# EAGLE design OBD_Reader (EAGLE 7.2.0)
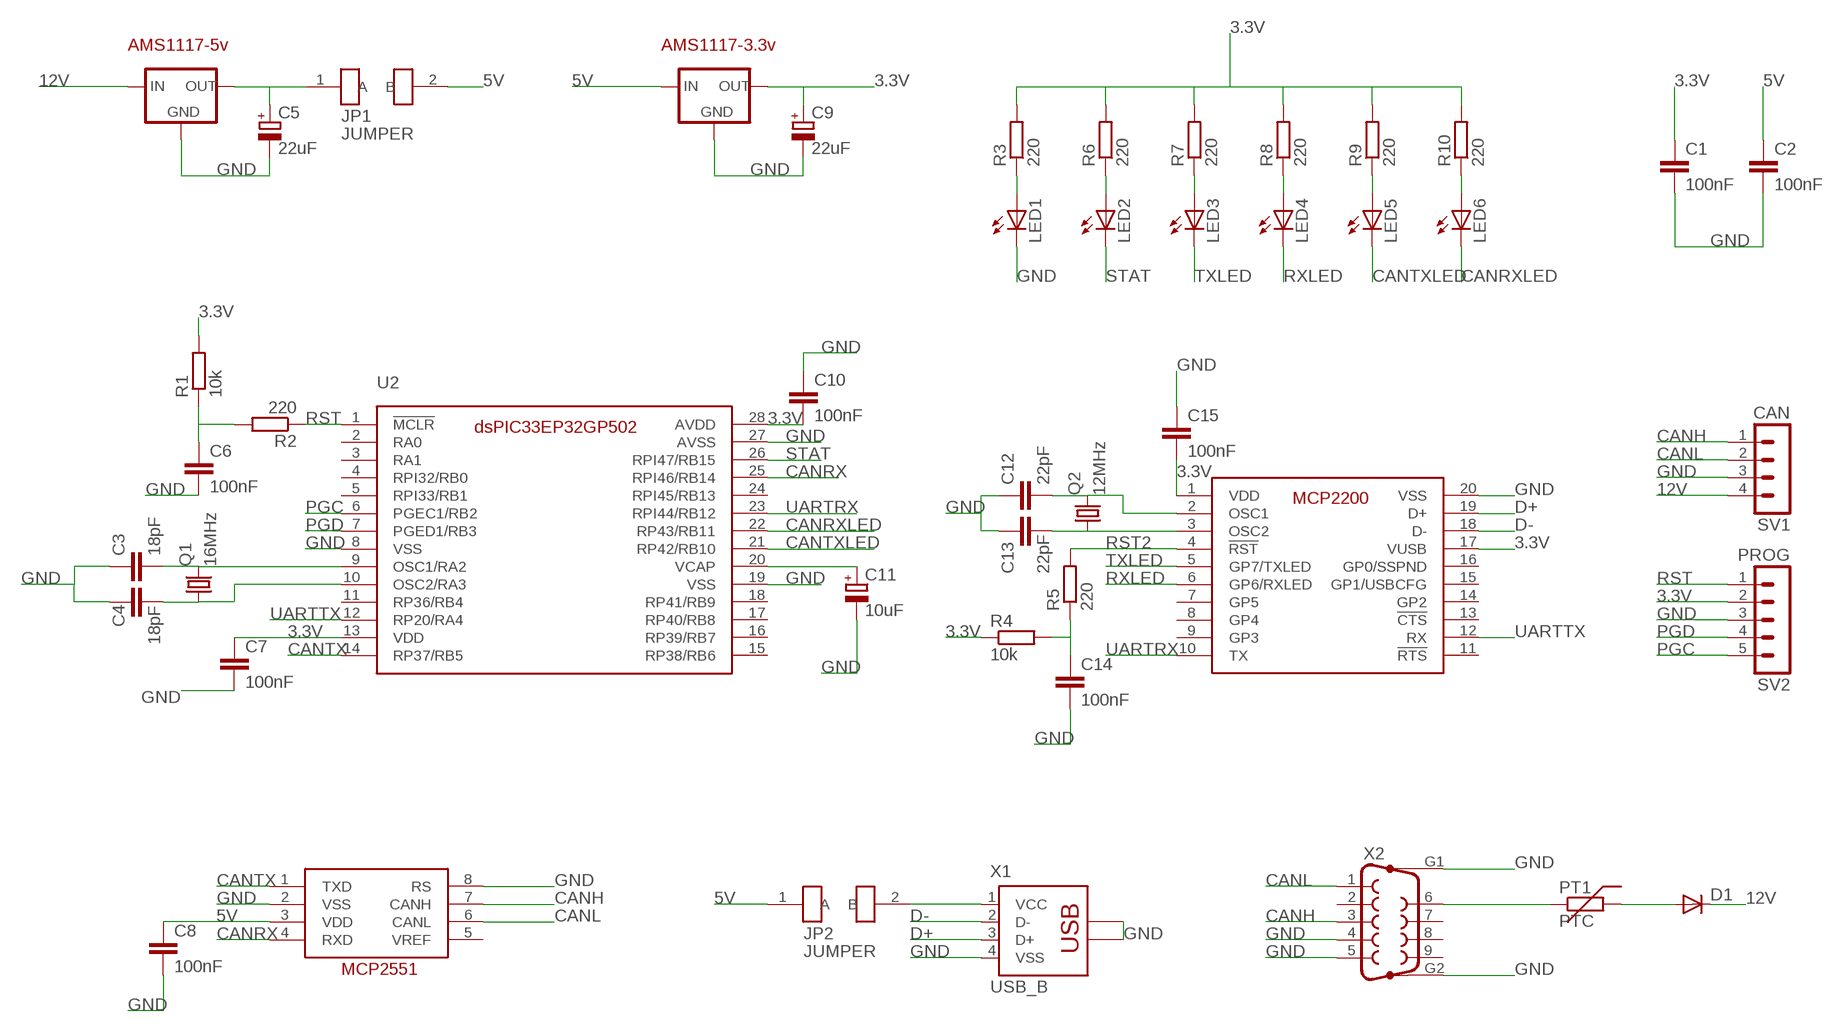
[diagram p0: schematic, sheet 1]

## Parts
C1  100nF  C-EUC0603  [C0603]
C2  100nF  C-EUC0603  [C0603]
C3  18pF  C-EUC0603  [C0603]
C4  18pF  C-EUC0603  [C0603]
C5  22uF  CPOL-EUCT3216  [CT3216]
C6  100nF  C-EUC0603  [C0603]
C7  100nF  C-EUC0603  [C0603]
C8  100nF  C-EUC0603  [C0603]
C9  22uF  CPOL-EUCT3216  [CT3216]
C10  100nF  C-EUC0603  [C0603]
C11  10uF  CPOL-EUCT3216  [CT3216]
C12  22pF  C-EUC0603  [C0603]
C13  22pF  C-EUC0603  [C0603]
C14  100nF  C-EUC0603  [C0603]
C15  100nF  C-EUC0603  [C0603]
D1  DIODE-SMB  [SMB]
JP1  JUMPER  [1206]
JP2  JUMPER  [1206]
LED1  LEDCHIPLED_0603  [CHIPLED_0603]
LED2  LEDCHIPLED_0603  [CHIPLED_0603]
LED3  LEDCHIPLED_0603  [CHIPLED_0603]
LED4  LEDCHIPLED_0603  [CHIPLED_0603]
LED5  LEDCHIPLED_0603  [CHIPLED_0603]
LED6  LEDCHIPLED_0603  [CHIPLED_0603]
PT1  PTC  [PTC_1206]
Q1  16MHz  CRYSTALHC49S  [HC49/S]
Q2  12MHz  CRYSTALHC49S  [HC49/S]
R1  10k  R-EU_R0603  [R0603]
R2  220  R-EU_R0603  [R0603]
R3  220  R-EU_R0603  [R0603]
R4  10k  R-EU_R0603  [R0603]
R5  220  R-EU_R0603  [R0603]
R6  220  R-EU_R0603  [R0603]
R7  220  R-EU_R0603  [R0603]
R8  220  R-EU_R0603  [R0603]
R9  220  R-EU_R0603  [R0603]
R10  220  R-EU_R0603  [R0603]
SV1  CAN  MA04-1  [MA04-1]
SV2  PROG  MA05-1  [MA05-1]
U1  AMS1117_5V  [SOT-223]
U2  DSPIC33EP32GP502  [SSOP28]
U3  MCP2551  [SOIC20]
U4  AMS1117_3.3V  [SOT-223]
U5  MCP2200  [SSOP20]
X1  USB_B  [85-32004-00X]
X2  F09HP  [F09HP]

## Nets
3.3V: C1.1 C7.1 C9.+ C10.2 C15.2 R1.2 R3.2 R4.1 R6.2 R7.2 R8.2 R9.2 R10.2 SV2.2 U2.13(VDD) U2.28(AVDD) U4.2(OUT) U5.1(VDD) U5.17(VUSB)
5V: C2.1 C8.1 JP1.2(B) JP2.1(A) U3.3(VDD) U4.3(IN)
12V: D1.C SV1.4 U1.3(IN)
CANH: SV1.1 U3.7(CANH) X2.3
CANL: SV1.2 U3.6(CANL) X2.1
CANRX: U2.25(RPI46/RB14) U3.4(RXD)
CANRXLED: LED6.C U2.22(RP43/RB11)
CANTX: U2.14(RP37/RB5) U3.1(TXD)
CANTXLED: LED5.C U2.21(RP42/RB10)
D+: U5.19(D+) X1.3(D+)
D-: U5.18(D-) X1.2(D-)
GND: C1.2 C2.2 C3.1 C4.1 C5.- C6.2 C7.2 C8.2 C9.- C10.1 C11.- C12.1 C13.1 C14.2 C15.1 LED1.C SV1.3 SV2.3 U1.1(GND) U2.8(VSS) U2.19(VSS) U2.27(AVSS) U3.2(VSS) U3.8(RS) U4.1(GND) U5.20(VSS) X1.4(VSS) X1.M1(C1) X1.M2(C2) X2.4 X2.5 X2.G1 X2.G2
N$1: C3.2 Q1.2 U2.9(OSC1/RA2)
N$2: C4.2 Q1.1 U2.10(OSC2/RA3)
N$3: C14.1 R4.2 R5.1
N$4: C12.2 Q2.2 U5.2(OSC1)
N$5: C13.2 Q2.1 U5.3(OSC2)
N$6: C6.1 R1.1 R2.2
N$7: JP2.2(B) X1.1(VCC)
N$8: D1.A PT1.2
N$9: PT1.1 X2.6
N$10: C5.+ JP1.1(A) U1.2(OUT)
N$15: LED1.A R3.1
N$16: LED2.A R6.1
N$17: LED3.A R7.1
N$18: LED4.A R8.1
N$19: LED5.A R9.1
N$20: LED6.A R10.1
N$30: C11.+ U2.20(VCAP)
PGC: SV2.5 U2.6(PGEC1/RB2)
PGD: SV2.4 U2.7(PGED1/RB3)
RST: R2.1 SV2.1 U2.1(!MCLR)
RST2: R5.2 U5.4(!RST)
RXLED: LED4.C U5.6(GP6/RXLED)
STAT: LED2.C U2.26(RPI47/RB15)
TXLED: LED3.C U5.5(GP7/TXLED)
UARTRX: U2.23(RPI44/RB12) U5.10(TX)
UARTTX: U2.12(RP20/RA4) U5.12(RX)
Unconnected: U2.2(RA0) U2.3(RA1) U2.4(RPI32/RB0) U2.5(RPI33/RB1) U2.11(RP36/RB4) U2.15(RP38/RB6) U2.16(RP39/RB7) U2.17(RP40/RB8) U2.18(RP41/RB9) U2.24(RPI45/RB13) U3.5(VREF) U5.7(GP5) U5.8(GP4) U5.9(GP3) U5.11(!RTS) U5.13(!CTS) U5.14(GP2) U5.15(GP1/USBCFG) U5.16(GP0/SSPND) X2.2 X2.7 X2.8 X2.9

## Library data of the parts
C1-C4 C6-C8 C10 C12-C15 = resistor:C-EU: CAPACITOR, European symbol
C5 C9 C11 = resistor:CPOL-EU: POLARIZED CAPACITOR, European symbol
D1 = diode:DIODE-: DIODE
JP1 JP2 = Rober-Microchip:JUMPER
LED1-LED6 = led:LED: LED OSRAM: - CHIPLED LG R971, LG N971, LY N971, LG Q971, LY Q971, LO R971, LY R971 LH N974, LH R974 LS Q976, LO Q976, LY Q976 LO Q996 - Hyper CHIPLED LW Q18S LB Q993, LB Q99A, LB R99A - SideLED LS A670, LO A670, LY A670, LG A670, LP A670 LB A673, LV A673, LT A673, LW A673 LH A674 LY A675 LS A676, LA A676, LO A676, LY A676, LW A676 LS A679, LY A679, LG A679 - Hyper Micro SIDELED® LS Y876, LA Y876, LO Y876, LY Y876 LT Y87S - SmartLED LW L88C, LW L88S LB L89C, LB L89S, LG L890 LS L89K, LO L89K, LY L89K LS L896, LA L896, LO L896, LY L896 - TOPLED LS T670, LO T670, LY T670, LG T670, LP T670 LSG T670, LSP T670, LSY T670, LOP T670, LYG T670 LG T671, LOG T671, LSG T671 LB T673, LV T673, LT T673, LW T673 LH T674 LS T676, LA T676, LO T676, LY T676, LB T676, LH T676, LSB T676, LW T676 LB T67C, LV T67C, LT T67C, LS T67K, LO T67K, LY T67K, LW E67C LS E67B, LA E67B, LO E67B, LY E67B, LB E67C, LV E67C, LT E67C LW T67C LS T679, LY T679, LG T679 LS T770, LO T770, LY T770, LG T770, LP T770 LB T773, LV T773, LT T773, LW T773 LH T774 LS E675, LA E675, LY E675, LS T675 LS T776, LA T776, LO T776, LY T776, LB T776 LHGB T686 LT T68C, LB T68C - Hyper Mini TOPLED® LB M676 - Mini TOPLED Santana® LG M470 LS M47K, LO M47K, LY M47K Source: http://www.osram.convergy.de LUXEON: - LUMILED® LXK2-PW12-R00, LXK2-PW12-S00, LXK2-PW14-U00, LXK2-PW14-V00 LXK2-PM12-R00, LXK2-PM12-S00, LXK2-PM14-U00 LXK2-PE12-Q00, LXK2-PE12-R00, LXK2-PE12-S00, LXK2-PE14-T00, LXK2-PE14-U00 LXK2-PB12-K00, LXK2-PB12-L00, LXK2-PB12-M00, LXK2-PB14-N00, LXK2-PB14-P00, LXK2-PB14-Q00 LXK2-PR12-L00, LXK2-PR12-M00, LXK2-PR14-Q00, LXK2-PR14-R00 LXK2-PD12-Q00, LXK2-PD12-R00, LXK2-PD12-S00 LXK2-PH12-R00, LXK2-PH12-S00 LXK2-PL12-P00, LXK2-PL12-Q00, LXK2-PL12-R00 Source: www.luxeon.com KINGBRIGHT: KA-3528ASYC Source: www.kingbright.com
PT1 = Rober-Microchip:PTC
Q1 Q2 = crystal:CRYSTAL: CRYSTAL; OC_FARNELL: 1667008; OC_NEWARK: unknown
R1-R10 = resistor:R-EU_: RESISTOR, European symbol
SV1 = con-lstb:MA04-1: PIN HEADER; OC_FARNELL: unknown; OC_NEWARK: unknown
SV2 = con-lstb:MA05-1: PIN HEADER; OC_FARNELL: unknown; OC_NEWARK: unknown
U1 = Rober-Microchip:AMS1117_5V
U2 = Rober-Microchip:DSPIC33EP32GP502: dsPIC33EP32GP502
U3 = Rober-Microchip:MCP2551: MCP2551
U4 = Rober-Microchip:AMS1117_3.3V
U5 = Rober-Microchip:MCP2200: MCP2200
X1 = Rober-Microchip:USB_B
X2 = con-subd:F09HP: SUB-D; OC_FARNELL: unknown; OC_NEWARK: unknown

## Board
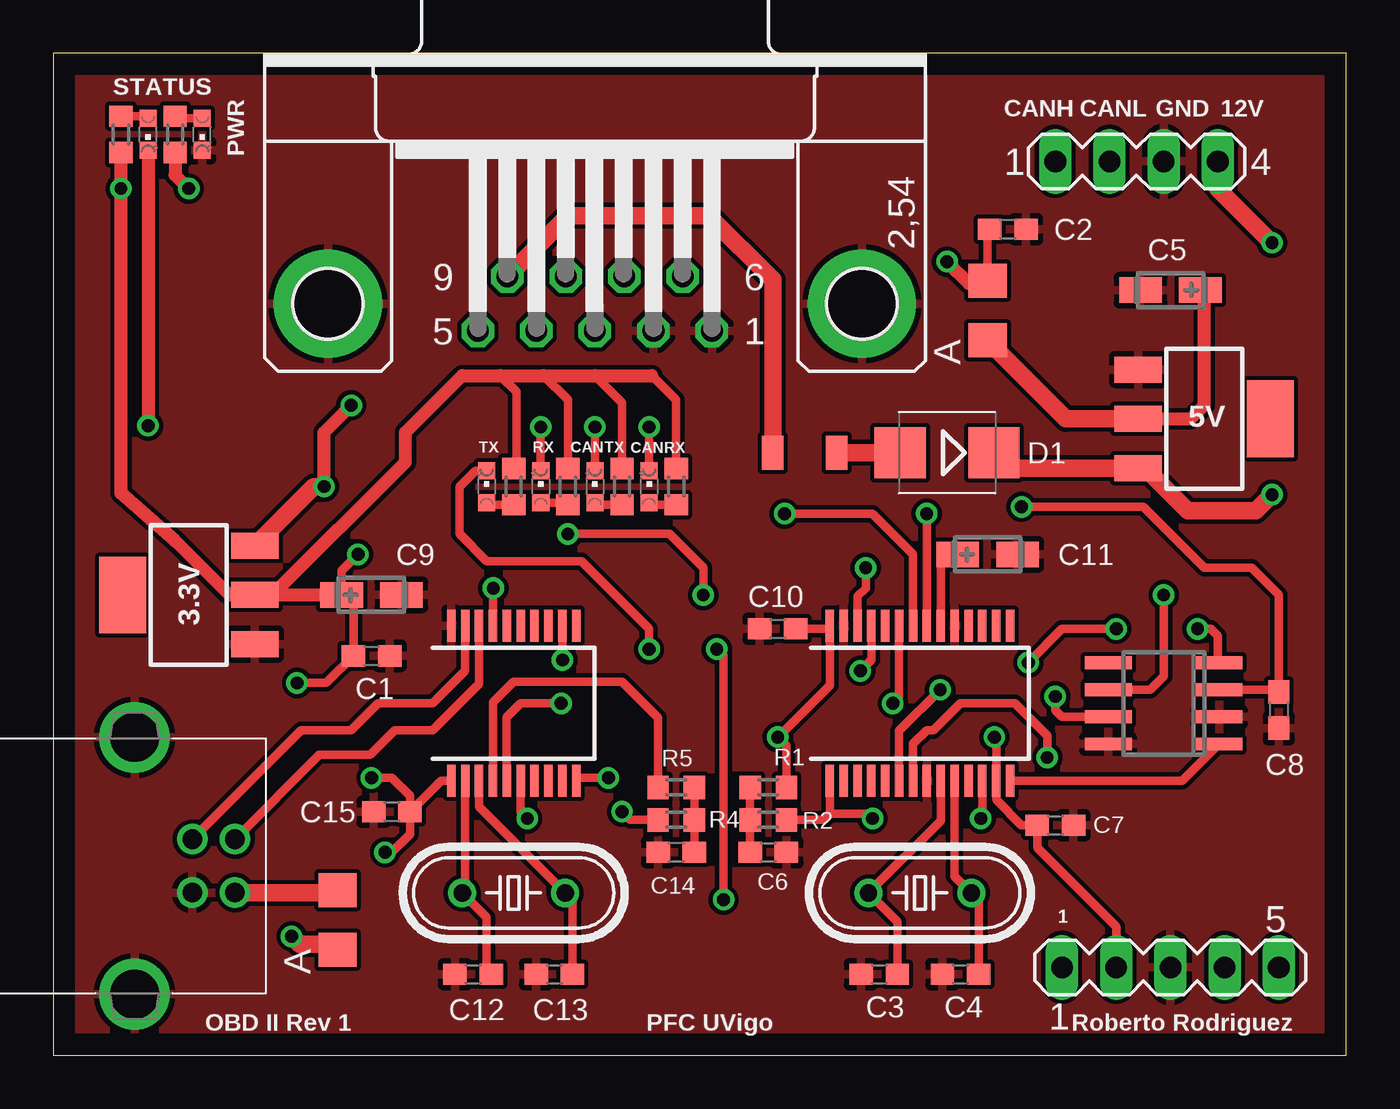
[diagram p1: board, top side]
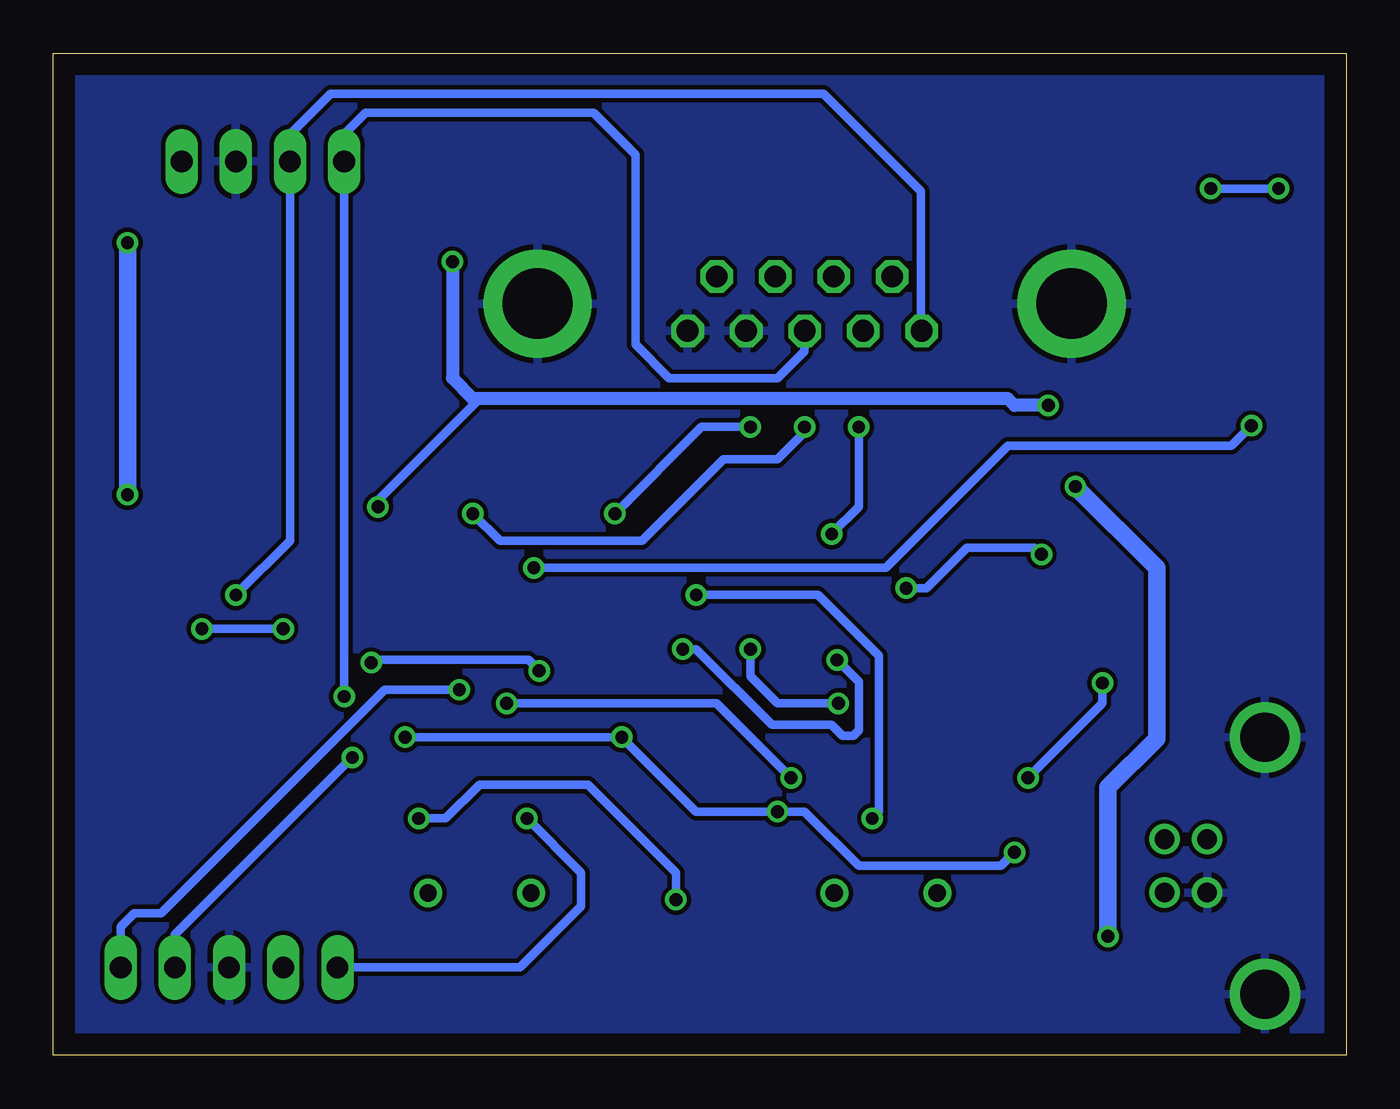
[diagram p2: board, bottom side, seen from below]

Size 60.63 x 46.98 mm. Coordinates in mm from the lower left corner, seen from the top.
Outline: 0,0 60.63,0 60.63,46.98 0,46.98 0,0
Copper layers (1*16): Top 0.035mm / dielectric 1.5mm / Bottom 0.035mm
Design rules "default *": minimum track width 10mil, minimum drill 12mil, track to track 8mil, track to pad 8mil, pad to pad 8mil, via to via 8mil, smd to smd 8mil, copper to edge 40mil, drill to drill 8mil, minimum pad ring 10mil, minimum via ring 8mil, stop-mask expansion 4mil, vias tented up to drill 0mil, thermal gap 10mil

### Footprints (pad centres in the part's own frame; a part is rotated, then mirrored left to right if it is on the bottom)
C0603 = smd 1.1 x 1: 1 -0.85,0; 2 0.85,0
CT3216 = smd 2 x 1.2: + -1.4,0; - 1.4,0
SMB = smd 2.4 x 2.4: A 2.2,0; C -2.2,0
1206 = smd 1.6 x 1.8: 1 -1.4,0; 2 1.4,0
CHIPLED_0603 = smd 0.8 x 0.8: A 0,-0.75; C 0,0.75
PTC_1206 = smd 1 x 1.6: 1 -1.5,0; 2 1.5,0
HC49/S = drill 0.813: 1 -2.413,0; 2 2.413,0
R0603 = smd 1 x 1.1: 1 -0.85,0; 2 0.85,0
MA04-1 = drill 1.016 long: 1 -3.81,0; 2 -1.27,0; 3 1.27,0; 4 3.81,0
MA05-1 = drill 1.016 long: 1 -5.08,0; 2 -2.54,0; 3 0,0; 4 2.54,0; 5 5.08,0
SOT-223 = smd 1.219 x 2.235: 1 0.229,-1.829; 2 2.54,-1.829; 3 4.851,-1.829 | smd 3.6 x 2.2: 4 2.54,4.369
SSOP28 = smd 0.4 x 1.5: 1 -4.225,-3.625; 2 -3.575,-3.625; 3 -2.925,-3.625; 4 -2.275,-3.625; 5 -1.625,-3.625; 6 -0.975,-3.625; 7 -0.325,-3.625; 8 0.325,-3.625; 9 0.975,-3.625; 10 1.625,-3.625; 11 2.275,-3.625; 12 2.925,-3.625; 13 3.575,-3.625; 14 4.225,-3.625; 15 4.225,3.625; 16 3.575,3.625; 17 2.925,3.625; 18 2.275,3.625; 19 1.625,3.625; 20 0.975,3.625; 21 0.325,3.625; 22 -0.325,3.625; 23 -0.975,3.625; 24 -1.625,3.625; 25 -2.275,3.625; 26 -2.925,3.625; 27 -3.575,3.625; 28 -4.225,3.625
SOIC20 = smd 0.6 x 2.2: 1 -1.905,-2.6; 2 -0.635,-2.6; 3 0.635,-2.6; 4 1.905,-2.6; 5 1.905,2.6; 6 0.635,2.6; 7 -0.635,2.6; 8 -1.905,2.6
SSOP20 = smd 0.4 x 1.5: 1 -2.925,-3.625; 2 -2.275,-3.625; 3 -1.625,-3.625; 4 -0.975,-3.625; 5 -0.325,-3.625; 6 0.325,-3.625; 7 0.975,-3.625; 8 1.625,-3.625; 9 2.275,-3.625; 10 2.925,-3.625; 11 2.925,3.625; 12 2.275,3.625; 13 1.625,3.625; 14 0.975,3.625; 15 0.325,3.625; 16 -0.325,3.625; 17 -0.975,3.625; 18 -1.625,3.625; 19 -2.275,3.625; 20 -2.925,3.625
85-32004-00X = drill 0.92 pad 1.27: 1 4.71,-1.25; 2 4.71,1.25; 3 2.71,1.25; 4 2.71,-1.25 | drill 2.3 pad 3: M1 0,6.02; M2 0,-6.02
F09HP = drill 1.016 octagon: 1 -5.486,-1.27; 2 -2.743,-1.27; 3 0,-1.27; 4 2.743,-1.27; 5 5.486,-1.27; 6 -4.115,1.27; 7 -1.372,1.27; 8 1.372,1.27; 9 4.115,1.27 | drill 3.302 pad 5.08: G1 -12.522,0; G2 12.522,0

### Placement (x,y rotation side)
C1  14.92,18.73 0 top
C2  44.77,38.73 0 top
C3  38.73,3.81 0 top
C4  42.55,3.81 0 top
C5  52.39,35.88 180 top
C6  33.53,9.53 0 top
C7  46.99,10.79 0 top
C8  57.47,16.19 270 top
C9  14.92,21.59 0 top
C10  33.97,20 0 top
C11  43.81,23.5 0 top
C12  19.68,3.81 0 top
C13  23.5,3.81 0 top
C14  29.21,9.53 180 top
C15  15.88,11.43 0 top
D1  41.91,28.26 180 top
JP1  43.81,34.92 90 top
JP2  13.34,6.35 90 top
LED1  6.99,43.18 180 top
LED2  4.45,43.18 180 top
LED3  20.32,26.67 0 top
LED4  22.86,26.67 0 top
LED5  25.4,26.67 0 top
LED6  27.94,26.67 0 top
PT1  35.24,28.26 0 top
Q1  40.64,7.62 180 top
Q2  21.59,7.62 180 top
R1  33.53,12.57 0 top
R2  33.53,11.05 180 top
R3  5.71,43.18 270 top
R4  29.21,11.05 0 top
R5  29.21,12.57 180 top
R6  3.17,43.18 270 top
R7  21.59,26.67 90 top
R8  24.13,26.67 90 top
R9  26.67,26.67 90 top
R10  29.21,26.67 90 top
SV1  50.8,41.91 0 top
SV2  52.39,4.13 0 top
U1  52.7,32.38 270 top
U2  40.64,16.51 0 top
U3  52.07,16.51 90 top
U4  7.62,19.05 90 top
U5  21.59,16.51 0 top
X1  3.81,8.89 0 top
X2  25.4,35.24 0 top

### Tracks (layer width: path | path; a pad name or v marks a point on that pad's centre or on a via)
3.3V  (via drill 0.6)
  Top 0.406: 34.48,12.68 R1.2 34.38,14.52 v33.97,14.92 36.41,17.36 U2.28 36.28,20 C10.2 | U5.1 18.18,12.88 C15.2 | 10.16,21.59 U4.2 | v14.92,13.02 15.88,13.02 16.73,12.17 C15.2 | C15.2 16.73,10.38 15.88,9.53 v15.56,9.53 | U5.17 20.61,21.89 v20.64,21.91 | v14.29,23.5 13.52,22.73 C9.+ 14.07,21.04 C1.1 12.8,17.46 v11.43,17.46 | v44.13,14.92 44.22,14.84 U2.13 44.22,11.98 45.39,10.8 46.13,10.8 C7.1 46.14,9.74 49.85,6.03 SV2.2 | R10.2 29.21,30.73 28.07,31.88 | R9.2 26.67,30.61 25.4,31.88 | R8.2 24.13,30.73 22.99,31.88 | R7.2 21.59,27.56 21.72,27.69 21.72,31.11 20.95,31.88 | 28.23,10.67 R4.1 27.05,11.05 v26.67,11.43
  Top 0.61: U4.2 8.26,21.59 5.71,24.13 3.17,26.35 v3.17,40.64 R6.2 | R3.2 5.71,41.27 v6.35,40.64 | 10.29,21.59 C9.+ | 10.16,21.59 10.29,21.59 | 10.29,21.59 16.51,27.81 16.51,29.21 19.18,31.88 20.95,31.88 22.99,31.88 25.4,31.88 28.07,31.88
  Bottom 0.406: v6.35,40.64 v3.17,40.64 | v15.56,9.53 16.19,8.89 22.86,8.89 25.4,11.43 v26.67,11.43 30.48,11.43 v33.97,14.92 v44.13,14.92 | v20.64,21.91 19.68,21.91 17.78,23.81 14.61,23.81 v14.29,23.5 | v14.92,13.02 11.43,16.51 v11.43,17.46
5V  (via drill 0.6)
  Top 0.406: C8.1 57.37,17.14 U3.3 57.47,17.14 57.47,21.59 56.2,22.86 53.98,22.86 51.12,25.72 v45.4,25.72 | JP1.2 43.81,38.63 C2.1 | JP2.1 13.34,5.21
  Top 0.61: v12.7,26.67 12.7,29.21 v13.97,30.48 | JP1.2 43.69,36.2 42.93,36.2 v41.91,37.21
  Top 0.813: v12.7,26.67 12.22,26.67 U4.3 | 13.34,5.21 11.56,5.21 v11.18,5.59
  Bottom 0.406: v45.4,25.72 45.4,26.04 40.64,30.8
  Bottom 0.61: v13.97,30.48 15.56,30.48 15.88,30.8 40.64,30.8 40.96,30.8 41.91,31.75 v41.91,37.21
  Bottom 0.813: v12.7,26.67 8.89,22.86 8.89,14.86 11.18,12.57 v11.18,5.59
12V  (via drill 0.6)
  Top 0.813: D1.C 44.83,27.53 U1.3 51.21,27.53 53.21,25.53 56.39,25.53 v57.15,26.29 | SV1.4 54.61,40.64 v57.15,38.1
  Bottom 0.813: v57.15,26.29 v57.15,38.1
CANH  (via drill 0.6)
  Top 0.406: v46.99,16.83 46.99,16.19 47.31,15.88 U3.7
  Bottom 0.406: v46.99,16.83 SV1.1 46.99,43.18 45.97,44.2 35.31,44.2 33.34,42.23 33.34,33.34 31.75,31.75 26.67,31.75 25.4,33.02 X2.3
CANL  (via drill 0.6)
  Top 0.406: U3.6 51.44,17.14 52.07,17.78 v52.07,21.59
  Bottom 0.406: v52.07,21.59 49.53,24.13 SV1.2 49.53,43.18 47.62,45.09 24.51,45.09 19.94,40.51 19.94,34 X2.1
CANRX  (via drill 0.6)
  Top 0.406: v45.72,18.41 47.31,20 v49.85,20 | v53.66,20 54.29,20 54.61,19.68 54.61,18.48 U3.4 | U2.25 38.37,18.55 v37.85,18.03
  Bottom 0.406: v49.85,20 v53.66,20 | v37.85,18.03 38.35,18.54 45.59,18.54 v45.72,18.41
CANRXLED  (via drill 0.6)
  Top 0.406: v34.29,25.4 38.42,25.4 40.32,23.5 40.32,20.14 U2.22 | LED6.C v27.94,29.46
  Bottom 0.406: v27.94,29.46 30.23,29.46 v34.29,25.4
CANTX
  Top 0.406: U2.14 52.95,12.88 U3.1
CANTXLED  (via drill 0.6)
  Top 0.406: v40.96,25.4 40.96,20.14 U2.21 | LED5.C v25.4,29.46
  Bottom 0.406: v25.4,29.46 25.4,29.21 26.67,27.94 29.21,27.94 33.02,24.13 39.69,24.13 v40.96,25.4
D+
  Top 0.406: U5.19 19.32,18.05 17.78,16.51 15.24,16.51 13.97,15.24 11.62,15.24 X1.3
D-
  Top 0.406: U5.18 19.96,17.43 17.78,15.24 16,15.24 14.86,14.1 12.48,14.1 X1.2
GND
  pour Top: -1.27,48.26 62.23,48.26 62.23,-1.27 -1.27,-1.27
  pour Bottom: 0,48.26 -1.27,48.26 -1.27,-1.27 62.23,-1.27 62.23,48.26
N$1
  Top 0.406: C3.2 39.59,6.26 Q1.2 41.62,11.01 U2.9
N$2
  Top 0.406: U2.10 42.27,8.41 Q1.1 43.4,7.28 C4.2
N$3
  Top 0.406: C14.1 R4.2 R5.1
N$4
  Top 0.406: U5.2 19.32,7.76 Q2.2 20.32,6.48 20.32,4.03 C12.2
N$5
  Top 0.406: U5.3 19.96,11.66 Q2.1 24.34,7.28 C13.2
N$6
  Top 0.406: C6.1 R2.2 R1.1
N$7
  Top 0.813: X1.1 13.22,7.64 JP2.2
N$8
  Top 0.813: D1.A PT1.2
N$9
  Top 0.813: PT1.1 33.74,36.36 30.73,39.37 24.14,39.37 X2.6
N$10
  Top 0.61: U1.2 53.34,29.84 53.98,30.48 53.98,35.69
  Top 0.813: 53.98,35.69 C5.+ | U1.2 47.49,29.84 JP1.1
N$15
  Top 0.406: LED1.A 5.82,43.93 R3.1
N$16
  Top 0.406: R6.1 4.34,44.03 LED2.A
N$17
  Top 0.406: 20.42,25.82 R7.1
  Top 0.61: 20.42,25.82 LED3.A
N$18
  Top 0.406: LED4.A 24.03,25.92
  Top 0.61: 24.03,25.92 R8.1
N$19
  Top 0.406: 25.5,25.82 R9.1
  Top 0.61: 25.5,25.82 LED5.A
N$20
  Top 0.406: 28.04,25.82 R10.1
  Top 0.61: 28.04,25.82 LED6.A
N$30
  Top 0.406: U2.20 41.62,23.33 C11.+
PGC  (via drill 0.6)
  Top 0.406: U2.6 39.66,15.22 v41.59,17.14
  Bottom 0.406: v41.59,17.14 45.09,17.14 55.56,6.67 56.83,6.67 57.47,6.03 SV2.5
PGD  (via drill 0.6)
  Top 0.406: U2.7 40.31,13.96 40.32,13.97 40.32,14.61 40.96,15.24 41.27,15.24 42.55,16.51 45.09,16.51 46.61,14.99 v46.61,13.97
  Bottom 0.406: v46.61,13.97 54.93,5.65 SV2.4
RST  (via drill 0.6)
  Top 0.406: U2.1 36.41,11.33 | v38.42,11.11 38.2,11.33 36.41,11.33 | R2.1 36.13,11.05 36.41,11.33
  Bottom 0.406: SV2.1 38.73,4.13 35.88,6.99 35.88,8.57 v38.42,11.11
RST2
  Top 0.406: U5.4 20.61,16.55 21.59,17.53 26.67,17.53 28.36,15.84 R5.2
RXLED  (via drill 0.6)
  Top 0.406: 24.13,24.13 v24.13,24.45 28.89,24.45 30.48,22.86 v30.48,21.59 | 21.91,11.43 v22.23,11.11 21.91,11.42 U5.6 | LED4.C v22.86,29.46
  Bottom 0.406: v22.86,29.46 22.86,25.72 v24.13,24.45 | v30.48,21.59 24.77,21.59 21.91,18.73 21.91,11.43 v22.23,11.11
STAT  (via drill 0.6)
  Top 0.406: v38.1,22.86 38.1,21.91 37.72,21.52 U2.26
  Top 0.61: LED2.C v4.45,29.53
  Bottom 0.406: v38.1,22.86 21.59,22.86 15.88,28.57 5.4,28.57 v4.45,29.53
TXLED  (via drill 0.6)
  Top 0.406: U5.5 21.27,15.87 21.91,16.51 v23.81,16.51 | v27.94,19.05 27.94,20 24.77,23.18 20.32,23.18 19.05,24.45 19.05,26.67 19.8,27.42 LED3.C
  Bottom 0.406: v23.81,16.51 26.67,16.51 27.94,17.78 v27.94,19.05
UARTRX  (via drill 0.6)
  Top 0.406: U2.23 39.66,16.8 v39.37,16.51 | v26.04,13.02 24.65,13.02 U5.10
  Bottom 0.406: v39.37,16.51 29.53,16.51 v26.04,13.02
UARTTX  (via drill 0.6)
  Top 0.406: U2.12 43.56,11.18 v43.5,11.11 | v31.43,7.3 31.43,18.73 v31.11,19.05 | v23.88,18.54 23.88,20.12 U5.12
  Bottom 0.406: v43.5,11.11 42.23,11.11 40.64,12.7 35.56,12.7 31.43,8.57 v31.43,7.3 | v31.11,19.05 30.48,19.05 26.92,15.49 24.13,15.49 23.62,14.99 23.11,14.99 22.86,15.24 22.86,17.53 v23.88,18.54

### Text on the board
tNames: STATUS | CANH | CANL | GND | 12V | PWR | 5V | TX | RX | CANTX | CANRX | 3.3V | 1 | OBD II Rev 1 | PFC UVigo | Roberto Rodriguez